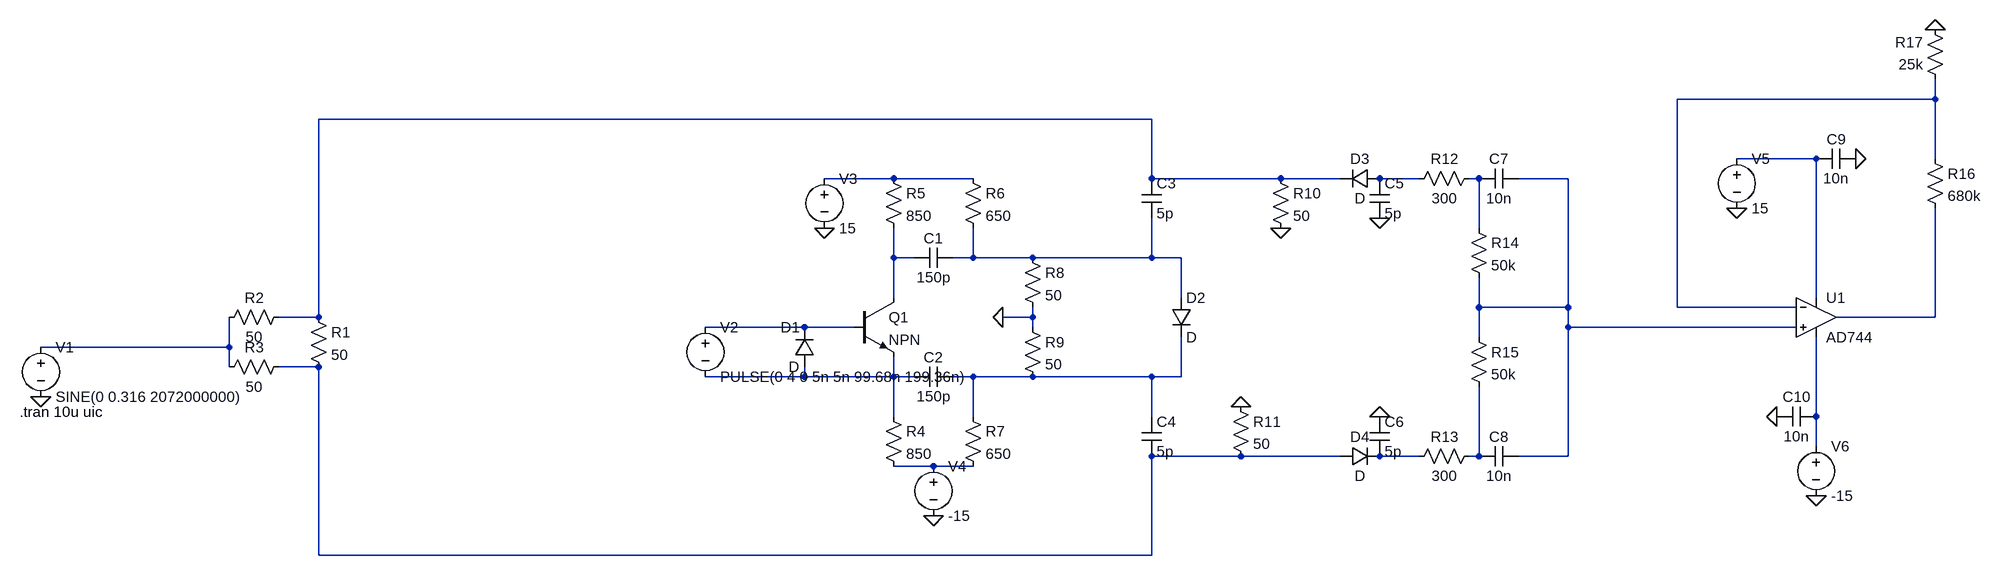
[diagram p0: schematic Phase_gate_assembly.asc]
Phase_gate_assembly.asc, the LTspice schematic file:
Version 4
SHEET 1 2980 680
WIRE 2496 -176 2496 -208
WIRE 2496 -176 2080 -176
WIRE 1232 -144 -112 -144
WIRE 2304 -80 2176 -80
WIRE 2496 -80 2496 -176
WIRE 816 -48 704 -48
WIRE 944 -48 816 -48
WIRE 1232 -48 1232 -144
WIRE 1440 -48 1232 -48
WIRE 1536 -48 1440 -48
WIRE 1664 -48 1600 -48
WIRE 1760 -48 1744 -48
WIRE 1904 -48 1824 -48
WIRE 1760 32 1760 -48
WIRE 816 80 816 32
WIRE 848 80 816 80
WIRE 944 80 944 32
WIRE 944 80 912 80
WIRE 1040 80 944 80
WIRE 1232 80 1232 16
WIRE 1232 80 1040 80
WIRE 1280 80 1232 80
WIRE 816 144 816 80
WIRE 1280 144 1280 80
WIRE 2304 144 2304 -80
WIRE 1760 160 1760 112
WIRE 1904 160 1904 -48
WIRE 1904 160 1760 160
WIRE 2080 160 2080 -176
WIRE 2272 160 2080 160
WIRE -112 176 -112 -144
WIRE -112 176 -176 176
WIRE 1040 176 1040 160
WIRE 1040 176 992 176
WIRE 2496 176 2496 0
WIRE 2496 176 2336 176
WIRE 672 192 512 192
WIRE 752 192 672 192
WIRE 1040 192 1040 176
WIRE 1904 192 1904 160
WIRE 2272 192 1904 192
WIRE 1760 208 1760 160
WIRE -256 224 -256 176
WIRE -256 224 -560 224
WIRE -256 256 -256 224
WIRE -112 256 -176 256
WIRE 672 272 672 256
WIRE 672 272 512 272
WIRE 816 272 816 240
WIRE 816 272 672 272
WIRE 848 272 816 272
WIRE 944 272 912 272
WIRE 1040 272 944 272
WIRE 1232 272 1040 272
WIRE 1280 272 1280 208
WIRE 1280 272 1232 272
WIRE 816 336 816 272
WIRE 944 336 944 272
WIRE 1232 336 1232 272
WIRE 2304 336 2304 208
WIRE 2304 384 2304 336
WIRE 1376 400 1232 400
WIRE 1536 400 1376 400
WIRE 1664 400 1600 400
WIRE 1760 400 1760 288
WIRE 1760 400 1744 400
WIRE 1904 400 1904 192
WIRE 1904 400 1824 400
WIRE 880 416 816 416
WIRE 944 416 880 416
WIRE -112 560 -112 256
WIRE 1232 560 1232 400
WIRE 1232 560 -112 560
FLAG -560 304 0
FLAG 992 176 0
FLAG 880 496 0
FLAG 704 32 0
FLAG 1376 320 0
FLAG 1440 32 0
FLAG 1600 336 0
FLAG 1600 16 0
FLAG 2176 0 0
FLAG 2304 464 0
FLAG 2368 -80 0
FLAG 2240 336 0
FLAG 2496 -288 0
SYMBOL res -128 160 R0
SYMATTR InstName R1
SYMATTR Value 50
SYMBOL res -160 160 R90
WINDOW 0 0 56 VBottom 2
WINDOW 3 32 56 VTop 2
SYMATTR InstName R2
SYMATTR Value 50
SYMBOL res -160 240 R90
WINDOW 0 0 56 VBottom 2
WINDOW 3 32 56 VTop 2
SYMATTR InstName R3
SYMATTR Value 50
SYMBOL voltage -560 208 R0
WINDOW 123 0 0 Left 0
WINDOW 39 0 0 Left 0
SYMATTR InstName V1
SYMATTR Value SINE(0 0.316 2072000000)
SYMBOL voltage 512 176 R0
WINDOW 123 0 0 Left 0
WINDOW 39 0 0 Left 0
SYMATTR InstName V2
SYMATTR Value PULSE(0 4 0 5n 5n 99.68n 199.36n)
SYMBOL npn 752 144 R0
SYMATTR InstName Q1
SYMBOL res 800 320 R0
SYMATTR InstName R4
SYMATTR Value 850
SYMBOL res 800 -64 R0
SYMATTR InstName R5
SYMATTR Value 850
SYMBOL res 928 -64 R0
SYMATTR InstName R6
SYMATTR Value 650
SYMBOL res 928 320 R0
SYMATTR InstName R7
SYMATTR Value 650
SYMBOL cap 912 64 R90
WINDOW 0 0 32 VBottom 2
WINDOW 3 32 32 VTop 2
SYMATTR InstName C1
SYMATTR Value 150p
SYMBOL cap 912 256 R90
WINDOW 0 0 32 VBottom 2
WINDOW 3 32 32 VTop 2
SYMATTR InstName C2
SYMATTR Value 150p
SYMBOL res 1024 64 R0
SYMATTR InstName R8
SYMATTR Value 50
SYMBOL res 1024 176 R0
SYMATTR InstName R9
SYMATTR Value 50
SYMBOL diode 1264 144 R0
SYMATTR InstName D2
SYMBOL cap 1216 -48 R0
SYMATTR InstName C3
SYMATTR Value 5p
SYMBOL cap 1216 336 R0
SYMATTR InstName C4
SYMATTR Value 5p
SYMBOL voltage 704 -64 R0
WINDOW 123 0 0 Left 0
WINDOW 39 0 0 Left 0
SYMATTR InstName V3
SYMATTR Value 15
SYMBOL voltage 880 400 R0
WINDOW 123 0 0 Left 0
WINDOW 39 0 0 Left 0
SYMATTR InstName V4
SYMATTR Value -15
SYMBOL res 1424 -64 R0
SYMATTR InstName R10
SYMATTR Value 50
SYMBOL res 1360 304 R0
SYMATTR InstName R11
SYMATTR Value 50
SYMBOL diode 1600 -64 R90
WINDOW 0 0 32 VBottom 2
WINDOW 3 32 32 VTop 2
SYMATTR InstName D3
SYMBOL diode 1536 416 R270
WINDOW 0 32 32 VTop 2
WINDOW 3 0 32 VBottom 2
SYMATTR InstName D4
SYMBOL cap 1584 -48 R0
SYMATTR InstName C5
SYMATTR Value 5p
SYMBOL cap 1584 336 R0
SYMATTR InstName C6
SYMATTR Value 5p
SYMBOL res 1760 -64 R90
WINDOW 0 0 56 VBottom 2
WINDOW 3 32 56 VTop 2
SYMATTR InstName R12
SYMATTR Value 300
SYMBOL res 1760 384 R90
WINDOW 0 0 56 VBottom 2
WINDOW 3 32 56 VTop 2
SYMATTR InstName R13
SYMATTR Value 300
SYMBOL res 1744 16 R0
SYMATTR InstName R14
SYMATTR Value 50k
SYMBOL res 1744 192 R0
SYMATTR InstName R15
SYMATTR Value 50k
SYMBOL cap 1824 -64 R90
WINDOW 0 0 32 VBottom 2
WINDOW 3 32 32 VTop 2
SYMATTR InstName C7
SYMATTR Value 10n
SYMBOL cap 1824 384 R90
WINDOW 0 0 32 VBottom 2
WINDOW 3 32 32 VTop 2
SYMATTR InstName C8
SYMATTR Value 10n
SYMBOL voltage 2176 -96 R0
WINDOW 123 0 0 Left 0
WINDOW 39 0 0 Left 0
SYMATTR InstName V5
SYMATTR Value 15
SYMBOL voltage 2304 368 R0
WINDOW 123 0 0 Left 0
WINDOW 39 0 0 Left 0
SYMATTR InstName V6
SYMATTR Value -15
SYMBOL cap 2368 -96 R90
WINDOW 0 0 32 VBottom 2
WINDOW 3 32 32 VTop 2
SYMATTR InstName C9
SYMATTR Value 10n
SYMBOL cap 2304 320 R90
WINDOW 0 0 32 VBottom 2
WINDOW 3 32 32 VTop 2
SYMATTR InstName C10
SYMATTR Value 10n
SYMBOL res 2480 -96 R0
SYMATTR InstName R16
SYMATTR Value 680k
SYMBOL res 2512 -192 R180
WINDOW 0 36 76 Left 2
WINDOW 3 36 40 Left 2
SYMATTR InstName R17
SYMATTR Value 25k
SYMBOL OpAmps\\AD744 2304 112 R0
SYMATTR InstName U1
SYMBOL diode 688 256 R180
WINDOW 0 24 64 Left 2
WINDOW 3 24 0 Left 2
SYMATTR InstName D1
TEXT -594 328 Left 2 !.tran 10u uic

The netlist it stands for:
* Phase_gate_assembly.asc
R1 N002 N013 50
R2 N002 N012 50
R3 N013 N012 50
V1 N012 0 SINE(0 0.316 2072000000)
V2 N011 N014 PULSE(0 4 0 5n 5n 99.68n 199.36n)
Q1 N008 N011 N014 0 NPN
R4 N014 N019 850
R5 N004 N008 850
R6 N004 N009 650
R7 N015 N019 650
C1 N009 N008 150p
C2 N015 N014 150p
R8 N009 0 50
R9 0 N015 50
D2 N009 N015 D
C3 N002 N009 5p
C4 N015 N013 5p
V3 N004 0 15
V4 N019 0 -15
R10 N002 0 50
R11 0 N013 50
D3 N005 N002 D
D4 N013 N017 D
C5 N005 0 5p
C6 0 N017 5p
R12 N006 N005 300
R13 N018 N017 300
R14 N006 N007 50k
R15 N007 N018 50k
C7 N007 N006 10n
C8 N007 N018 10n
V5 N003 0 15
V6 N016 0 -15
C9 0 N003 10n
C10 N016 0 10n
R16 N001 N010 680k
R17 N001 0 25k
XU1 N007 N001 N003 N016 N010 AD744  ; pins In+ In- V+ V- OUT
D1 N014 N011 D
.model D D
.lib standard.dio
.model NPN NPN
.model PNP PNP
.lib standard.bjt
.tran 10u uic
.backanno
.end